# Altium schematic sheet ADC_AUX.SchDoc: Auxillary ADC
size 420 x 297 mm; Author: P. Zdunek; DrawnBy: P. Zdunek; Organization: Altium Limited; Address1: L3, 12a Rodborough Rd; Address2: Frenchs Forest; Address3: NSW; Address4: Australia 2086; DocumentNumber: 10; SheetNumber: 10; SheetTotal: 37; ModifiedBy: -; CheckedDate: -; Title2: Fast Stabilizer; DivGrp: WUT ISE; Designer: G.Kasprowicz
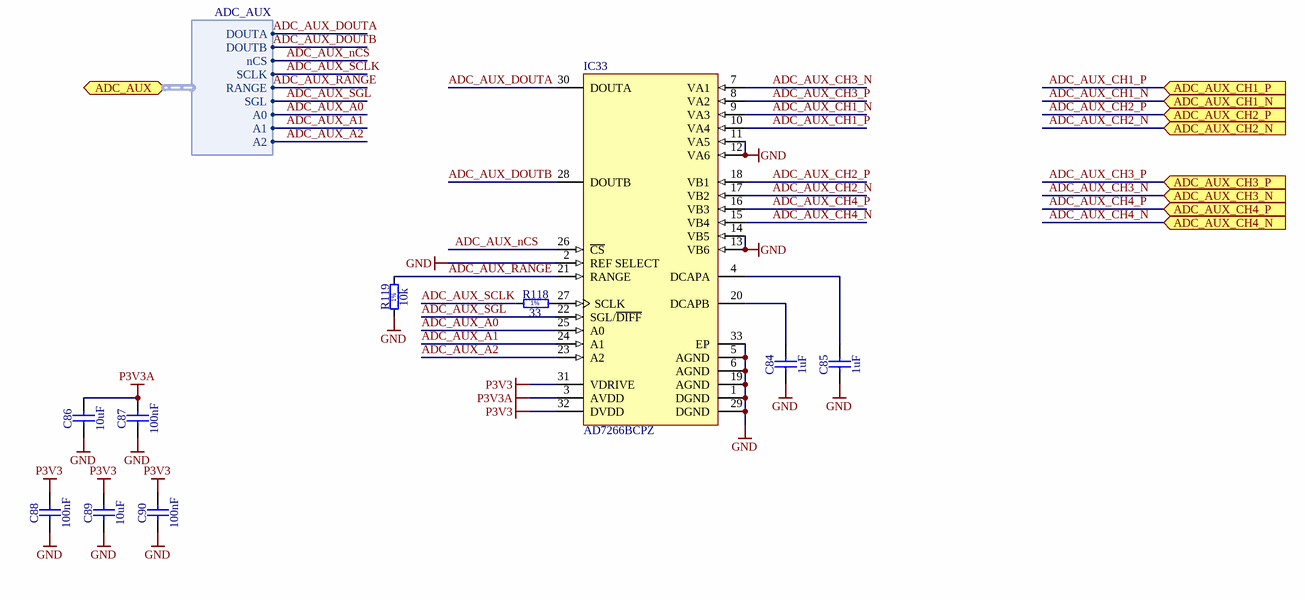
[diagram p0: ADC_AUX.SchDoc]

## Parts
C84  1uF  [CAPC1005X55N]
C85  1uF  [CAPC1005X55N]
C86  10uF  [CAPC1608X80N]
C87  100nF  [CAPC1005X55N]
C88  100nF  [CAPC1005X55N]
C89  10uF  [CAPC1608X80N]
C90  100nF  [CAPC1005X55N]
IC33  AD7266BCPZ  [CP-32-2_N]
R118  33  [RESC1005X40N]
R119  10k  [RESC1005X40N]

## Ports
ADC_AUX (bidir, harness ADC_AUX), ADC_AUX_CH1_N (in), ADC_AUX_CH1_P (in), ADC_AUX_CH2_N (in), ADC_AUX_CH2_P (in), ADC_AUX_CH3_N (in), ADC_AUX_CH3_P (in), ADC_AUX_CH4_N (in), ADC_AUX_CH4_P (in)

## Harnesses
ADC_AUX: DOUTA, DOUTB, nCS, RANGE, SCLK, SGL, A0, A1, A2

## Nets
GND: C84.1 C85.1 C86.1 C87.1 C88.1 C89.1 C90.1 IC33.1(DGND) IC33.2(REF_SELECT) IC33.5(AGND) IC33.6(AGND) IC33.11(VA5) IC33.12(VA6) IC33.13(VB6) IC33.14(VB5) IC33.19(AGND) IC33.29(DGND) IC33.33(EP) R119.1
P3V3: C88.2 C89.2 C90.2 IC33.31(VDRIVE) IC33.32(DVDD)
P3V3A: C86.2 C87.2 IC33.3(AVDD)
ADC_AUX_A0: IC33.25(A0) ; port ADC_AUX.A0
ADC_AUX_A1: IC33.24(A1) ; port ADC_AUX.A1
ADC_AUX_A2: IC33.23(A2) ; port ADC_AUX.A2
ADC_AUX_CH1_N: IC33.9(VA3) ; port ADC_AUX_CH1_N
ADC_AUX_CH1_P: IC33.10(VA4) ; port ADC_AUX_CH1_P
ADC_AUX_CH2_N: IC33.17(VB2) ; port ADC_AUX_CH2_N
ADC_AUX_CH2_P: IC33.18(VB1) ; port ADC_AUX_CH2_P
ADC_AUX_CH3_N: IC33.7(VA1) ; port ADC_AUX_CH3_N
ADC_AUX_CH3_P: IC33.8(VA2) ; port ADC_AUX_CH3_P
ADC_AUX_CH4_N: IC33.15(VB4) ; port ADC_AUX_CH4_N
ADC_AUX_CH4_P: IC33.16(VB3) ; port ADC_AUX_CH4_P
ADC_AUX_DOUTA: IC33.30(DOUTA) ; port ADC_AUX.DOUTA
ADC_AUX_DOUTB: IC33.28(DOUTB) ; port ADC_AUX.DOUTB
ADC_AUX_nCS: IC33.26(~{CS}) ; port ADC_AUX.nCS
ADC_AUX_RANGE: IC33.21(RANGE) R119.2 ; port ADC_AUX.RANGE
ADC_AUX_SCLK: R118.1 ; port ADC_AUX.SCLK
ADC_AUX_SGL: IC33.22(SGL/~{DIFF}) ; port ADC_AUX.SGL
NetC84_2: C84.2 IC33.20(DCAPB)
NetC85_2: C85.2 IC33.4(DCAPA)
NetIC33_27: IC33.27(SCLK) R118.2

## Notes on the sheet
- Project/Equipment
- Document
- Designer
- Drawn by
- Check.by
- Copyright WUT ISE 2020.
  This documentation describes Open Hardware and is licensed under the CERN OHL v.1.2. You may redistribute and modify this documentation under the terms of the CERN OHL v.1.2. (http://ohwr.org/CERNOHL). This documentation is distributed WITHOUT ANY EXPRESS OR IMPLIED WARRANTY, INCLUDING OF MERCHANTABILITY, SATISFACTORY QUALITY AND FITNESS FOR A PARTICULAR PURPOSE. Please see the CERN OHL v.1.2 for applicable conditions.
- Contact
- File
- Last Mod.
- Print Date
- Sheet
- Size
- A3
- of
- Rev
- (in symbol R0402_10K_1%_0.0625W_100PPM) 1%
- (in symbol R0402_33R_1%_0.0625W_100PPM) 1%

## Library data of the parts
C84 C85 = CC0402_1UF_16V_10%_X5R: Non-polarised capacitor; Part Description: SMD Multilayer Chip Ceramic Capacitor; Manufacturer: GENERIC; Manufacturer1 Part Number: C1005X5R1C105KT; Voltage: 16V; TC: X5R; Tolerance: ±10%; Part Number: CC0402_1UF_16V_10%_X5R; Component Kind: Standard; Component Type: Standard; Pin Count: 2; Value: 1uF; Status: Preferred; Manufacturer Part Number: CC0402_1UF_16V_10%_X5R; Case: 0402; Mounted: Yes; Socket: No; SMD: Yes; Sense: No; Manufacturer1 Example: TDK; Manufacturer1 ComponentHeight: 0.55mm; HelpURL: \\cern.ch\dfs\Applications\Altium\Datasheets\CC0402_X5R_TDK_C.pdf; Author: CERN DEM JLC; CreateDate: 25.10.2012; LatestRevisionDate: 25.10.2012
C86 C89 = CC0603_10UF_10V_10%_X5R: Non-polarised capacitor; Part Description: SMD Multilayer Chip Ceramic Capacitor; Manufacturer: GENERIC; Manufacturer1 Part Number: GRM188R61A106KE69D; Voltage: 10V; TC: X5R; Tolerance: ±10%; Part Number: CC0603_10UF_10V_10%_X5R; Component Kind: Standard; Component Type: Standard; Pin Count: 2; Value: 10uF; Status: None; Manufacturer Part Number: CC0603_10UF_10V_10%_X5R; Case: 0603; Mounted: Yes; Socket: No; SMD: Yes; Sense: No; Manufacturer1 Example: MURATA; Manufacturer1 ComponentHeight: 0.8mm; HelpURL: \\cern.ch\dfs\Applications\Altium\Datasheets\CC0603_MURATA_GRM188R61A106KE69D.pdf; Author: CERN DEM JLC; CreateDate: 31-Jan-17; LatestRevisionDate: 31-Jan-17
C87 C88 C90 = CC0402_100NF_16V_10%_X7R: Non-polarised capacitor; Part Description: SMD Multilayer Chip Ceramic Capacitor; Manufacturer: GENERIC; Manufacturer1 Part Number: GRM155R71C104KA88D; Voltage: 16V; TC: X7R; Tolerance: ±10%; Part Number: CC0402_100NF_16V_10%_X7R; Component Kind: Standard; Component Type: Standard; Pin Count: 2; Value: 100nF; Status: Not Recommended; Manufacturer Part Number: CC0402_100NF_16V_10%_X7R; Case: 0402; Mounted: Yes; Socket: No; SMD: Yes; Sense: No; Manufacturer1 Example: MURATA; Manufacturer1 ComponentHeight: 0.55mm; HelpURL: \\cern.ch\dfs\Applications\Altium\Datasheets\CC0402_X7R_MURATA_GRM.pdf; Author: CERN DEM JLC; CreateDate: 05-Dec-13; LatestRevisionDate: 03-Dec-07
IC33 = CMP-0313-00285-2: 1Dual 12-Bit SAR Analog-to-Digital Converter with Serial, SPI Interface, 2MSPS, -40 to +125 degC, CP-32-2, Pb-Free, Tray; Manufacturer: Analog Devices; Generic Part Number: AD7266; Throughput Rate (SPS): 2M; Interface: Ser, SPI; Resolution (Bits): 12; DatasheetVersion: Rev.B; ComponentLink1Description: Manufacturer URL; RoHS: Y; ComponentLink4Description: Product URL; ComponentLink2URL: http://www.analog.com/static/imported-files/data_sheets/AD7266.pdf; Channels: 12; PartNumber: AD7266BCPZ; ComponentLink2Description: Datasheet; Code_JEDEC: MO-220-VHHD-2; PackageReference: CP-32-2; Packing: Tray; ComponentLink3URL: http://www.analog.com/static/imported-files/packages/414143737956480539664569CP_32_2.pdf; PackageVersion: Jan-2005; ComponentLink4URL: http://www.analog.com/en/analog-to-digital-converters/ad-converters/ad7266/products/product.html; Mounting Technology: Surface Mount; PackageDescription: 32-Lead Lead Frame Chip Scale Package [LFCSP_VQ] 5 x 5 mm Body, Very Thin Quad; ComponentLink1URL: http://www.analog.com/en/index.html; ComponentLink3Description: Package Specification
R118 = R0402_33R_1%_0.0625W_100PPM: Resistor - 1%; Part Description: General Purpose Thick Film Chip Resistor; Manufacturer: GENERIC; Manufacturer1 Part Number: 232270673309L; PressFit: No; TC: ±100ppm/°C; Part Number: R0402_33R_1%_0.0625W_100PPM; Component Kind: Standard; Component Type: Standard; Pin Count: 2; Value: 33; Status: Not Recommended; Manufacturer Part Number: R0402_33R_1%_0.0625W_100PPM; Case: 0402; Mounted: Yes; Sense: No; Socket: No; SMD: Yes; Manufacturer1 Example: YAGEO PHYCOMP; Manufacturer1 ComponentHeight: 0.4mm; HelpURL: \\cern.ch\dfs\Applications\Altium\Datasheets\R0402_Phycomp_RC0402.pdf; Author: CERN DEM JLC; CreateDate: 03-Dec-07; LatestRevisionDate: 17-Oct-12; Power: 0.0625W; Tolerance: ±1%
R119 = R0402_10K_1%_0.0625W_100PPM: Resistor - 1%; Part Description: General Purpose Thick Film Chip Resistor; Manufacturer: GENERIC; Manufacturer1 Part Number: 232270671003L; PressFit: No; TC: ±100ppm/°C; Part Number: R0402_10K_1%_0.0625W_100PPM; Component Kind: Standard; Component Type: Standard; Pin Count: 2; Value: 10k; Status: Not Recommended; Manufacturer Part Number: R0402_10K_1%_0.0625W_100PPM; Case: 0402; Mounted: Yes; Sense: No; Socket: No; SMD: Yes; Manufacturer1 Example: YAGEO PHYCOMP; Manufacturer1 ComponentHeight: 0.4mm; HelpURL: \\cern.ch\dfs\Applications\Altium\Datasheets\R0402_Phycomp_RC0402.pdf; Author: CERN DEM JLC; CreateDate: 03-Dec-07; LatestRevisionDate: 17-Oct-12; Power: 0.0625W; Tolerance: ±1%